# Altium schematic sheet [04] - USB.SchDoc
size A4
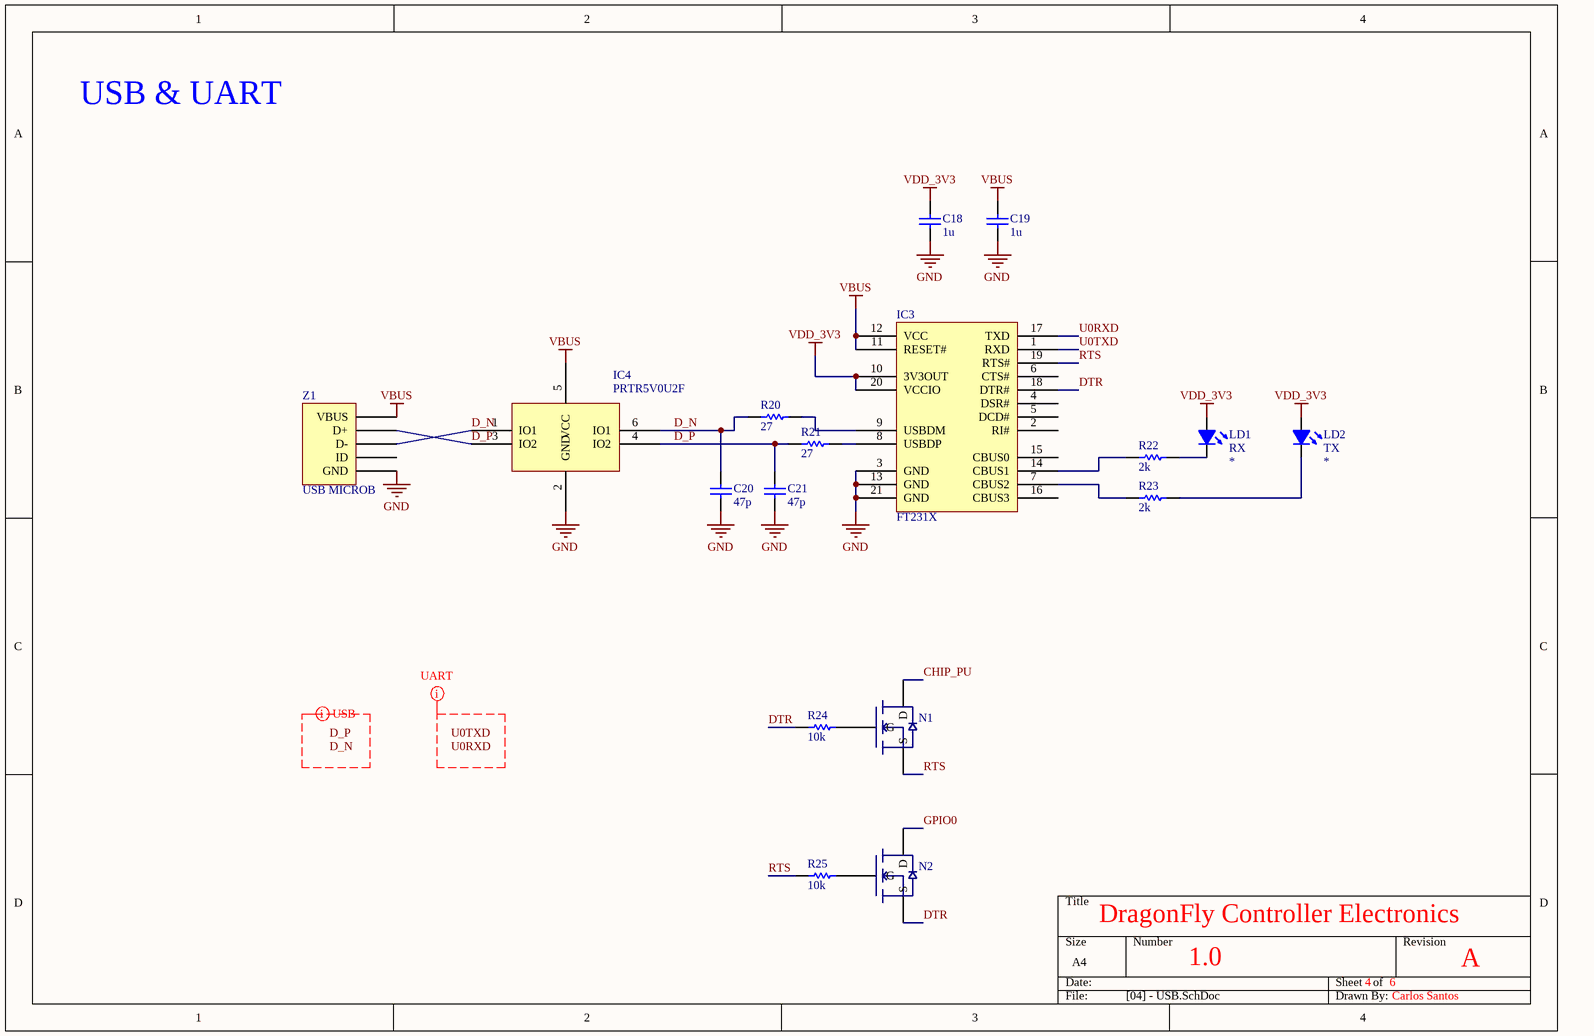
[diagram p0: [04] - USB.SchDoc]

## Parts
C18  value 1u  [0402 - Capacitor]  (hidden comment: Capacitor)
C19  value 1u  [0402 - Capacitor]  (hidden comment: Capacitor)
C20  value 47p  [0402 - Capacitor]  (hidden comment: Capacitor)
C21  value 47p  [0402 - Capacitor]  (hidden comment: Capacitor)
IC3  FT231X  [QFN20-127P600-8N]
IC4  PRTR5V0U2F  [SOT886]
LD1  Color: RX  [0402 - Led]  (hidden comment: Led)
LD2  Color: TX  [0402 - Led]  (hidden comment: Led)
N1  N-MOSFET  [DFN1006-3]  (value not drawn)
N2  N-MOSFET  [DFN1006-3]  (value not drawn)
R20  value 27  [0402 - Resistor]  (hidden comment: Resistor)
R21  value 27  [0402 - Resistor]  (hidden comment: Resistor)
R22  value 2k  [0402 - Resistor]  (hidden comment: Resistor)
R23  value 2k  [0402 - Resistor]  (hidden comment: Resistor)
R24  value 10k  [0402 - Resistor]  (hidden comment: Resistor)
R25  value 10k  [0402 - Resistor]  (hidden comment: Resistor)
Z1  USB MICROB  [USB - microB]

## Nets
GND: C18.1 C19.1 C20.1 C21.1 IC3.3(GND) IC3.13(GND) IC3.21(GND) IC4.2(GND) Z1.5(GND)
VBUS: C19.2 IC3.11(RESET#) IC3.12(VCC) IC4.5(VCC) Z1.1(VBUS)
VDD_3V3: C18.2 IC3.10(3V3OUT) IC3.20(VCCIO) LD1.1(A) LD2.1(A)
CHIP_PU: N1.3(D)
D_N: C20.2 IC4.1(IO1) IC4.6(IO1) R20.1 Z1.2(D-)
D_P: C21.2 IC4.3(IO2) IC4.4(IO2) R21.1 Z1.3(D+)
DTR: IC3.18(DTR#) N2.1(S) R24.1
GPIO0: N2.3(D)
RTS: IC3.19(RTS#) N1.1(S) R25.1
U0RXD: IC3.17(TXD)
U0TXD: IC3.1(RXD)
NetIC3_7: IC3.7(CBUS2) R23.1
NetIC3_8: IC3.8(USBDP) R21.2
NetIC3_9: IC3.9(USBDM) R20.2
NetIC3_14: IC3.14(CBUS1) R22.1
NetLD1_2: LD1.2(K) R22.2
NetLD2_2: LD2.2(K) R23.2
NetN1_2: N1.2(G) R24.2
NetN2_2: N2.2(G) R25.2

Not connected (* = marked no-connect by the designer): IC3 2(RI#) 4(DSR#) 5(DCD#) 6(CTS#) 15(CBUS0) 16(CBUS3); Z1 4(ID)

## Layout directives
net class UART: U0RXD, U0TXD
differential pair: D_N, D_P

## Notes on the sheet
- USB & UART
- DragonFly Controller Electronics
- 1.0
- 4
- 6
- A
- Carlos Santos
- Labels drawn without touching a wire or pin: D_N, D_P, U0RXD, U0TXD

## Library data of the parts
Z1 = USB - microB: 609-4613-1-ND; DigiKey Part #: 609-4613-1-ND
IC3 = FT231X: DigiKey Part #: 768-1128-1-ND
IC4 = PRTR5V0U2F: DigiKey Part #: 1727-4161-6-ND
LD1 LD2 = Led: Vf: *